# Altium schematic sheet 03_M.2_2230_E-KEY.SchDoc: M.2 2230 E-Key Connector
size 420 x 297 mm; Author: T. Ludemann; SheetNumber: 2; SheetTotal: 5; DocSize: DINA3
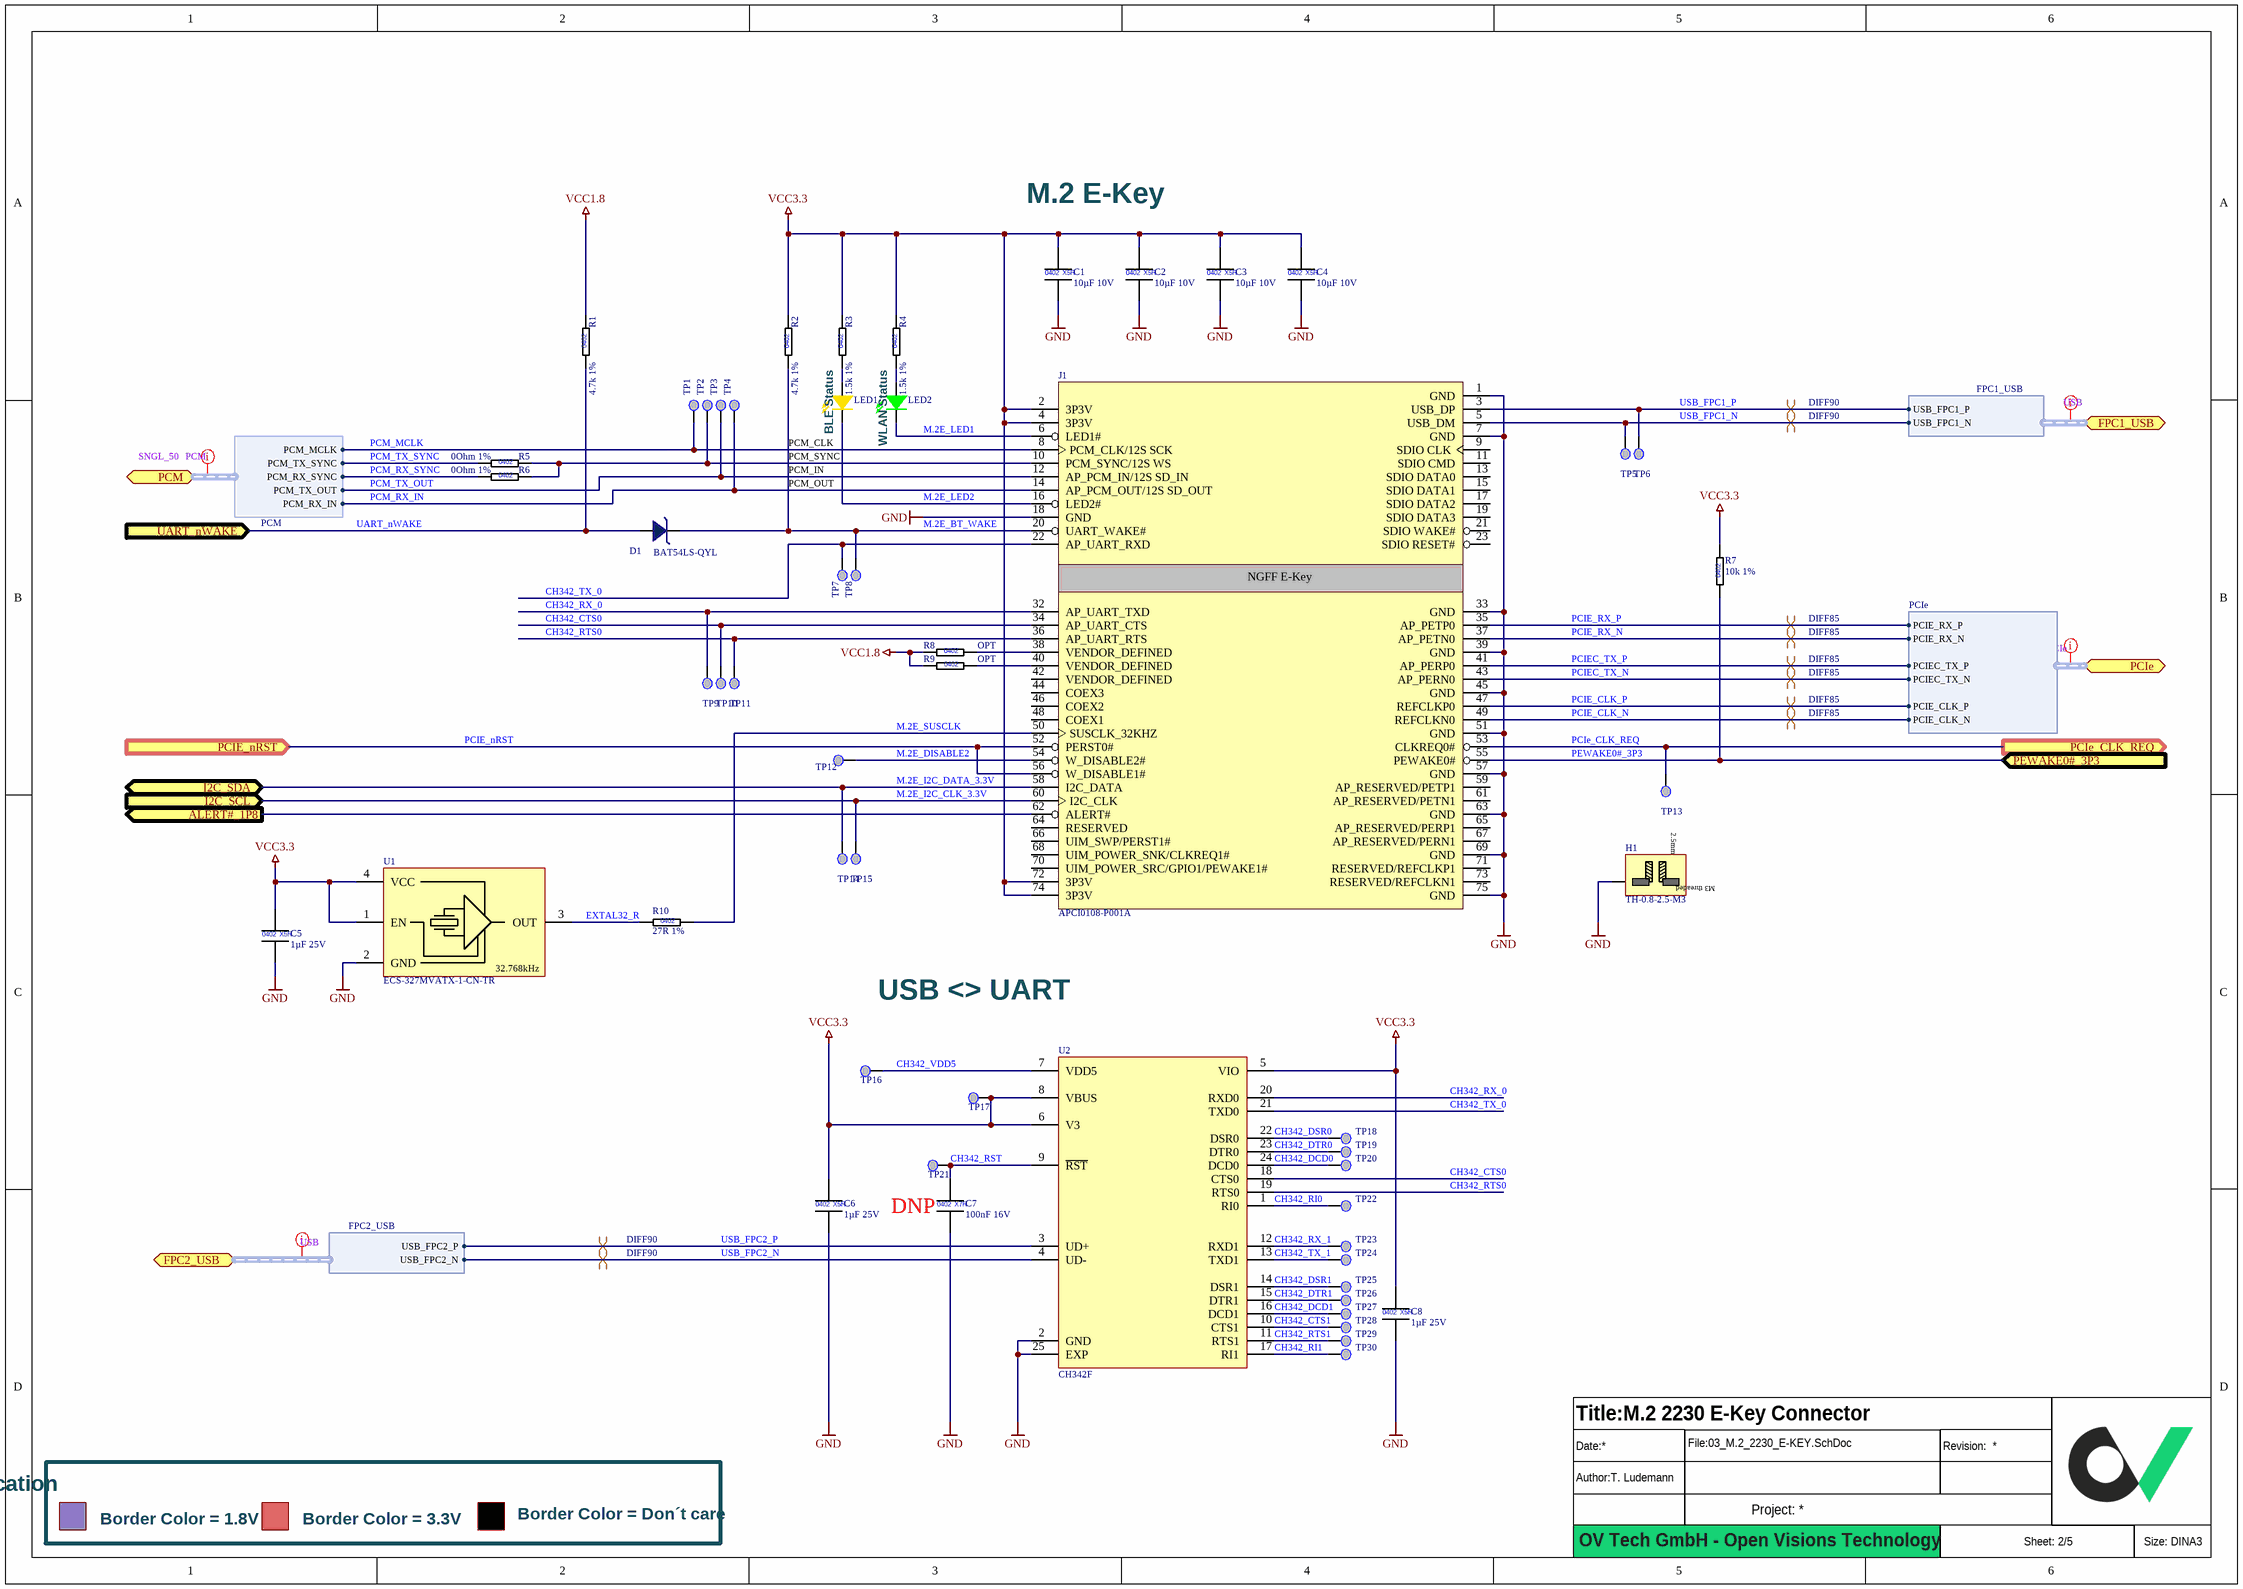
[diagram p0: 03_M.2_2230_E-KEY.SchDoc]

## Parts
?  (no value)  (graphical)
C1  10µF 10V  [CAPC1005X06L]
C2  10µF 10V  [CAPC1005X06L]
C3  10µF 10V  [CAPC1005X06L]
C4  10µF 10V  [CAPC1005X06L]
C5  1µF 25V  [CAPC1005X06L]
C6  1µF 25V  [CAPC1005X06L]
C7  100nF 16V  [CAPC1005X06L]
C8  1µF 25V  [CAPC1005X06L]
D1  BAT54LS-QYL  [DFN1006-2A]
H1  TH-0.8-2.5-M3  [Spacer_SMD_M3x2.5_TH-0.8-2.5-M3]
J1  APCI0108-P001A  [M.2 E-Key 4.2mm APCI0108-P001A]
LED1  LTST-S270KSKT  [LED 0605_LTST-S270KRKT]  (value not drawn)
LED2  LTST-S270KGKT  [LED 0605_LTST-S270KRKT]  (value not drawn)
R1  4.7k 1%  [RESC1005X04L]
R2  4.7k 1%  [RESC1005X04L]
R3  1.5k 1%  [RESC1005X04L]
R4  1.5k 1%  [RESC1005X04L]
R5  0Ohm 1%  [RESC1005X04L]
R6  0Ohm 1%  [RESC1005X04L]
R7  10k 1%  [RESC1005X04L]
R8  OPT  [RESC1005X04L]  (no BOM)
R9  OPT  [RESC1005X04L]  (no BOM)
R10  27R 1%  [RESC1005X04L]
TP1  Testpoint 0.5mm  [TP_0.50mm]  (value not drawn)  (no BOM)
TP2  Testpoint 0.5mm  [TP_0.50mm]  (value not drawn)  (no BOM)
TP3  Testpoint 0.5mm  [TP_0.50mm]  (value not drawn)  (no BOM)
TP4  Testpoint 0.5mm  [TP_0.50mm]  (value not drawn)  (no BOM)
TP5  Testpoint 0.5mm  [TP_0.50mm]  (value not drawn)  (no BOM)
TP6  Testpoint 0.5mm  [TP_0.50mm]  (value not drawn)  (no BOM)
TP7  Testpoint 0.5mm  [TP_0.50mm]  (value not drawn)  (no BOM)
TP8  Testpoint 0.5mm  [TP_0.50mm]  (value not drawn)  (no BOM)
TP9  Testpoint 0.5mm  [TP_0.50mm]  (value not drawn)  (no BOM)
TP10  Testpoint 0.5mm  [TP_0.50mm]  (value not drawn)  (no BOM)
TP11  Testpoint 0.5mm  [TP_0.50mm]  (value not drawn)  (no BOM)
TP12  Testpoint 0.5mm  [TP_0.50mm]  (value not drawn)  (no BOM)
TP13  Testpoint 0.5mm  [TP_0.50mm]  (value not drawn)  (no BOM)
TP14  Testpoint 0.5mm  [TP_0.50mm]  (value not drawn)  (no BOM)
TP15  Testpoint 0.5mm  [TP_0.50mm]  (value not drawn)  (no BOM)
TP16  Testpoint 0.5mm  [TP_0.50mm]  (value not drawn)  (no BOM)
TP17  Testpoint 0.5mm  [TP_0.50mm]  (value not drawn)  (no BOM)
TP18  Testpoint 0.5mm  [TP_0.50mm]  (value not drawn)  (no BOM)
TP19  Testpoint 0.5mm  [TP_0.50mm]  (value not drawn)  (no BOM)
TP20  Testpoint 0.5mm  [TP_0.50mm]  (value not drawn)  (no BOM)
TP21  Testpoint 0.5mm  [TP_0.50mm]  (value not drawn)  (no BOM)
TP22  Testpoint 0.5mm  [TP_0.50mm]  (value not drawn)  (no BOM)
TP23  Testpoint 0.5mm  [TP_0.50mm]  (value not drawn)  (no BOM)
TP24  Testpoint 0.5mm  [TP_0.50mm]  (value not drawn)  (no BOM)
TP25  Testpoint 0.5mm  [TP_0.50mm]  (value not drawn)  (no BOM)
TP26  Testpoint 0.5mm  [TP_0.50mm]  (value not drawn)  (no BOM)
TP27  Testpoint 0.5mm  [TP_0.50mm]  (value not drawn)  (no BOM)
TP28  Testpoint 0.5mm  [TP_0.50mm]  (value not drawn)  (no BOM)
TP29  Testpoint 0.5mm  [TP_0.50mm]  (value not drawn)  (no BOM)
TP30  Testpoint 0.5mm  [TP_0.50mm]  (value not drawn)  (no BOM)
U1  ECS-327MVATX-1-CN-TR  [OSCILLATOR_ECS-327MVATX_2X1.6X0.9]
U2  CH342F  [QFN50P400X400X75_HS-25L]

## Ports
ALERT#_1P8 (out), FPC1_USB (bidir, harness FPC1_USB), FPC2_USB (bidir, harness FPC2_USB), I2C_SCL (in), I2C_SDA (bidir), PCIe (bidir, harness PCIe), PCIe_CLK_REQ (out), PCIE_nRST (in), PCM (bidir, harness PCM), PEWAKE0#_3P3 (in), UART_nWAKE (in)

## Harnesses
FPC1_USB: USB_FPC1_P, USB_FPC1_N
PCIe: PCIE_CLK_N, PCIE_CLK_P, PCIEC_TX_N, PCIE_RX_P, PCIE_RX_N, PCIEC_TX_P
PCM: PCM_MCLK, PCM_TX_OUT, PCM_RX_IN, PCM_TX_SYNC, PCM_RX_SYNC
FPC2_USB: USB_FPC2_P, USB_FPC2_N

## Nets
GND: C1.2 C2.2 C3.2 C4.2 C5.2 C6.2 C7.2 C8.2 H1.MT J1.1(GND) J1.7(GND) J1.18(GND) J1.33(GND) J1.39(GND) J1.45(GND) J1.51(GND) J1.57(GND) J1.63(GND) J1.69(GND) J1.75(GND) U1.2(GND) U2.2(GND) U2.25(EXP)
VCC1.8: R1.2 R8.1 R9.1
VCC3.3: C1.1 C2.1 C3.1 C4.1 C5.1 C6.1 C8.1 J1.2(3P3V) J1.4(3P3V) J1.72(3P3V) J1.74(3P3V) R2.2 R3.2 R4.2 R7.2 TP17.TP U1.1(EN) U1.4(VCC) U2.5(VIO) U2.6(V3) U2.8(VBUS)
ALERT#_1P8: J1.62(ALERT#) ; port ALERT#_1P8
CH342_CTS0: J1.34(AP_UART_CTS) TP10.TP U2.18(CTS0)
CH342_CTS1: TP28.TP U2.10(CTS1)
CH342_DCD0: TP20.TP U2.24(DCD0)
CH342_DCD1: TP27.TP U2.16(DCD1)
CH342_DSR0: TP18.TP U2.22(DSR0)
CH342_DSR1: TP25.TP U2.14(DSR1)
CH342_DTR0: TP19.TP U2.23(DTR0)
CH342_DTR1: TP26.TP U2.15(DTR1)
CH342_RI0: TP22.TP U2.1(RI0)
CH342_RI1: TP30.TP U2.17(RI1)
CH342_RST: C7.1 TP21.TP U2.9(~{RST})
CH342_RTS0: J1.36(AP_UART_RTS) TP11.TP U2.19(RTS0)
CH342_RTS1: TP29.TP U2.11(RTS1)
CH342_RX_0: J1.32(AP_UART_TXD) TP9.TP U2.20(RXD0)
CH342_RX_1: TP23.TP U2.12(RXD1)
CH342_TX_0: J1.22(AP_UART_RXD) TP7.TP U2.21(TXD0)
CH342_TX_1: TP24.TP U2.13(TXD1)
CH342_VDD5: TP16.TP U2.7(VDD5)
EXTAL32_R: R10.1 U1.3(OUT)
M.2E_BT_WAKE: D1.1 J1.20(UART_WAKE#) R2.1 TP8.TP
M.2E_DISABLE2: J1.54(W_DISABLE2#) TP12.TP
M.2E_I2C_CLK_3.3V: J1.60(I2C_CLK) TP15.TP ; port I2C_SCL
M.2E_I2C_DATA_3.3V: J1.58(I2C_DATA) TP14.TP ; port I2C_SDA
M.2E_LED1: J1.6(LED1#) LED2.1
M.2E_LED2: J1.16(LED2#) LED1.1
M.2E_SUSCLK: J1.50(SUSCLK_32KHZ) R10.2
PCIE_CLK_N: J1.49(REFCLKN0) ; port PCIe.PCIE_CLK_N
PCIE_CLK_P: J1.47(REFCLKP0) ; port PCIe.PCIE_CLK_P
PCIe_CLK_REQ: J1.53(CLKREQ0#) TP13.TP ; port PCIe_CLK_REQ
PCIE_nRST: J1.52(PERST0#) J1.56(W_DISABLE1#) ; port PCIE_nRST
PCIE_RX_N: J1.37(AP_PETN0) ; port PCIe.PCIE_RX_N
PCIE_RX_P: J1.35(AP_PETP0) ; port PCIe.PCIE_RX_P
PCIEC_TX_N: J1.43(AP_PERN0) ; port PCIe.PCIEC_TX_N
PCIEC_TX_P: J1.41(AP_PERP0) ; port PCIe.PCIEC_TX_P
PCM_MCLK: J1.8(PCM_CLK/12S_SCK) TP1.TP ; port PCM.PCM_MCLK
PCM_RX_IN: J1.14(AP_PCM_OUT/12S_SD_OUT) TP4.TP ; port PCM.PCM_RX_IN
PCM_RX_SYNC: R6.1 ; port PCM.PCM_RX_SYNC
PCM_TX_OUT: J1.12(AP_PCM_IN/12S_SD_IN) TP3.TP ; port PCM.PCM_TX_OUT
PCM_TX_SYNC: R5.1 ; port PCM.PCM_TX_SYNC
PEWAKE0#_3P3: J1.55(PEWAKE0#) R7.1 ; port PEWAKE0#_3P3
UART_nWAKE: D1.2 R1.1 ; port UART_nWAKE
USB_FPC1_N: J1.5(USB_DM) TP5.TP ; port FPC1_USB.USB_FPC1_N
USB_FPC1_P: J1.3(USB_DP) TP6.TP ; port FPC1_USB.USB_FPC1_P
USB_FPC2_N: U2.4(UD-) ; port FPC2_USB.USB_FPC2_N
USB_FPC2_P: U2.3(UD+) ; port FPC2_USB.USB_FPC2_P
NetJ1_10: J1.10(PCM_SYNC/12S_WS) R5.2 R6.2 TP2.TP
NetJ1_38: J1.38(VENDOR_DEFINED) R8.2
NetJ1_40: J1.40(VENDOR_DEFINED) R9.2
NetLED1_2: LED1.2 R3.1
NetLED2_2: LED2.2 R4.1

Not connected (* = marked no-connect by the designer): J1 9(SDIO_CLK) 11(SDIO_CMD) 13(SDIO_DATA0) 15(SDIO_DATA1) 17(SDIO_DATA2) 19(SDIO_DATA3) 21(SDIO_WAKE#) 23(SDIO_RESET#) 42(VENDOR_DEFINED) 44(COEX3) 46(COEX2) 48(COEX1) 59(AP_RESERVED/PETP1) 61(AP_RESERVED/PETN1) 64(RESERVED) 65(AP_RESERVED/PERP1) 66(UIM_SWP/PERST1#) 67(AP_RESERVED/PERN1) 68(UIM_POWER_SNK/CLKREQ1#) 70(UIM_POWER_SRC/GPIO1/PEWAKE1#) 71(RESERVED/REFCLKP1) 73(RESERVED/REFCLKN1)

## Layout directives
net class USB: (no net found under the mark)
differential pair; differential pair class DIFF90: USB_FPC1_N, USB_FPC1_P, USB_FPC2_N, USB_FPC2_P
net class PCIe: (no net found under the mark)
differential pair; differential pair class DIFF85: PCIE_CLK_N, PCIE_CLK_P, PCIE_RX_N, PCIE_RX_P, PCIEC_TX_N, PCIEC_TX_P
net class PCM; net class SNGL_50: (no net found under the mark)

## Notes on the sheet
- M.2 E-Key
- (near R3) BLE Status
- (near R4) WLAN Status
- (near LED1) PCM_CLK
- PCM_SYNC
- PCM_IN
- PCM_OUT
- USB <> UART
- (near C7) DNP
- Signal Level Indication
- Border Color = 1.8V
- Border Color = 3.3V
- Border Color = Don´t care
- OV Tech GmbH - Open Visions Technology
- (in symbol CAP_0402_1µ_25V) 0402; X5R
- (in symbol CAP_0402_10µ_10V) 0402; X5R
- (in symbol CAP_0402_100nF_16V) 0402; X7R
- (in symbol Crystal Oscillator_ECS-327MVATX) 32.768kHz
- (in symbol M.2_E-Key_H4.2_APCI0108-P001A) NGFF E-Key
- (in symbol RES_0402_0R_1%) 0402
- (in symbol RES_0402_1.5k_1%) 0402
- (in symbol RES_0402_4.7k_1%) 0402
- (in symbol RES_0402_10k_1%) 0402
- (in symbol RES_0402_27R_1%) 0402
- (in symbol RES_0402_OPT) 0402
- (in symbol Spacer_SMD_M3_internal_2.5mm) 2.5mm; M3 threaded

## Library data of the parts
? = Titleblock_01_OpenSource
C1-C4 = CAP_0402_10µ_10V: Multilayer Ceramic Capacitors MLCC - SMD/SMT 0402 10VDC; Manufacturer 1: Murata Electronics; Manufacturer 1 Prt. Nr.: GRM155R61A475MEAAD; Manufacturer 2 Prt. Nr.: LMK105BBJ475MVLF; Manufacturer 2: Taiyo Yuden
C5 C6 C8 = CAP_0402_1µ_25V: Multilayer Ceramic Capacitors MLCC - SMD/SMT 0402 25VDC; Manufacturer 1: Murata Electronics; Manufacturer 1 Prt. Nr.: GRM155R61E105KE11D; Manufacturer 2 Prt. Nr.: 0402X105K250CT; Manufacturer 2: Walsin
C7 = CAP_0402_100nF_16V: Multilayer Ceramic Capacitors MLCC - SMD/SMT 0402 16VDC; Manufacturer 1: KYOCERA AVX; Manufacturer 1 Prt. Nr.: KGM05AR71C104KH; Manufacturer 2 Prt. Nr.: EMK105B7104KV-F; Manufacturer 2: Taiyo Yuden
D1 = Schottky 30V_BAT54LS-QYL: Schottky Diodes & Rectifiers; Manufacturer 1: Nexperia; Manufacturer 1 Prt. Nr.: BAT54LS-QYL
H1 = Spacer_SMD_M3_internal_2.5mm: Mac Eight SMD Spacer M3 2.5mm length; Manufacturer 1: Mac Eight; Manufacturer 1 Prt. Nr.: TH-0.8-2.5-M3
J1 = M.2_E-Key_H4.2_APCI0108-P001A: NGFF E-Key Card Edge Connector 4.2mm Height; Manufacturer 1: Lotes; Manufacturer 1 Prt. Nr.: APCI0108-P001A; Distributor 1: LCSC
LED1 = LED Yellow Sideview_LTST-S270KSKT: Standard LEDs 0605 Sideview - SMD Yellow Clear 589nm; Manufacturer 1: Lite-On; Manufacturer 1 Prt. Nr.: LTST-S270KGKT
LED2 = LED Green Sideview_LTST-S270KGKT: Standard LEDs 0605 Sideview - SMD Green Clear 571nm; Manufacturer 1: Lite-On; Manufacturer 1 Prt. Nr.: LTST-S270KGKT
R1 R2 = RES_0402_4.7k_1%: Thick Film Resistors - SMD 4.7k 1%; Manufacturer 1: Vishay / Dale; Manufacturer 1 Prt. Nr.: CRCW04024K70FKEDC; Manufacturer 2 Prt. Nr.: ERJ-PA2F4701X; Manufacturer 2: Panasonic
R3 R4 = RES_0402_1.5k_1%: Thick Film Resistors - SMD 1.5k 1%; Manufacturer 1: Vishay / Dale; Manufacturer 1 Prt. Nr.: CRCW04021K50FKED; Manufacturer 2 Prt. Nr.: RC0402FR-131K5L; Manufacturer 2: YAGEO
R5 R6 = RES_0402_0R_1%: Thick Film Resistors - SMD 0OHM 1%; Manufacturer 1: Bourns; Manufacturer 1 Prt. Nr.: CR0402AJ/-000GAS; Manufacturer 2 Prt. Nr.: AC0402FR-070RL; Manufacturer 2: YAGEO
R7 = RES_0402_10k_1%: Thick Film Resistors - SMD 10k 1%; Manufacturer 1: Vishay / Dale; Manufacturer 1 Prt. Nr.: CRCW040210K0FKEDC; Manufacturer 2 Prt. Nr.: RT0402FRE0710KL; Manufacturer 2: YAGEO
R8 R9 = RES_0402_OPT: Thick Film Resistors - SMD Optinal
R10 = RES_0402_27R_1%: Thick Film Resistors - SMD 27R 1%; Manufacturer 1: YAGEO; Manufacturer 1 Prt. Nr.: RC0402FR-0727RL; Manufacturer 2 Prt. Nr.: CRGCQ0402F27R; Manufacturer 2: TE Connectivity Passive Product
U1 = Crystal Oscillator_ECS-327MVATX: Crystal Oscillator 32.768kHz multivolt 2016 miniature SMD package; Manufacturer 1: ECS; Manufacturer 1 Prt. Nr.: ECS-2520MV-240-BN-TR
U2 = USB-UART_Converter_Dual_CH342F USB Uart converter 3MBaud: USB to Dual Serial Port CH342F 3MBaud; Manufacturer 1: WCH IC; Manufacturer 1 Prt. Nr.: CH342F; Distributor 1: LCSC